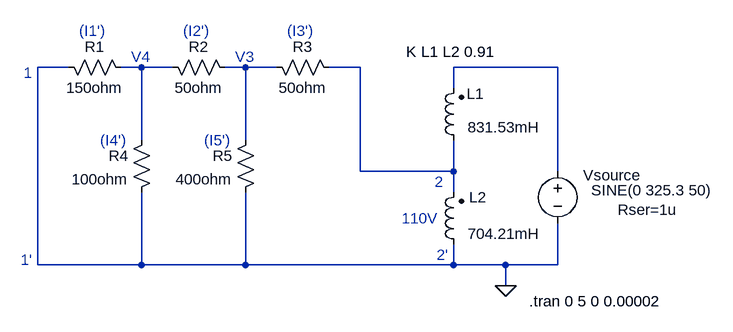
[diagram p0: schematic circuit2.asc]
circuit2.asc, the LTspice schematic file:
Version 4
SHEET 1 1092 680
WIRE 16 -224 -32 -224
WIRE 128 -224 96 -224
WIRE 176 -224 128 -224
WIRE 288 -224 256 -224
WIRE 336 -224 288 -224
WIRE 464 -224 416 -224
WIRE 768 -224 608 -224
WIRE 608 -192 608 -224
WIRE 128 -112 128 -224
WIRE 288 -112 288 -224
WIRE 464 -64 464 -224
WIRE 608 -64 608 -112
WIRE 608 -64 464 -64
WIRE 768 -64 768 -224
WIRE 608 -32 608 -64
WIRE -32 80 -32 -224
WIRE 128 80 128 -32
WIRE 128 80 -32 80
WIRE 288 80 288 -32
WIRE 288 80 128 80
WIRE 608 80 608 48
WIRE 608 80 288 80
WIRE 688 80 608 80
WIRE 768 80 768 16
WIRE 768 80 688 80
WIRE 688 112 688 80
FLAG 688 112 0
SYMBOL voltage 768 -80 M0
WINDOW 0 -128 22 Left 2
WINDOW 3 -238 45 Left 2
WINDOW 123 0 0 Left 0
WINDOW 39 -185 75 Left 2
SYMATTR InstName Vsource
SYMATTR Value SINE(0 325.3 50)
SYMATTR SpiceLine Rser=1u
SYMBOL ind2 624 -96 R180
WINDOW 0 -31 87 Left 2
WINDOW 3 -117 36 Left 2
SYMATTR InstName L1
SYMATTR Value 831.53mH
SYMATTR Type ind
SYMBOL ind2 624 64 R180
WINDOW 0 -35 88 Left 2
WINDOW 3 -117 32 Left 2
SYMATTR InstName L2
SYMATTR Value 704.21mH
SYMATTR Type ind
SYMBOL res 320 -240 M90
WINDOW 0 0 56 VBottom 2
WINDOW 3 32 56 VTop 2
SYMATTR InstName R3
SYMATTR Value 50ohm
SYMBOL res 160 -240 M90
WINDOW 0 0 56 VBottom 2
WINDOW 3 32 56 VTop 2
SYMATTR InstName R2
SYMATTR Value 50ohm
SYMBOL res 0 -240 M90
WINDOW 0 0 56 VBottom 2
WINDOW 3 32 56 VTop 2
SYMATTR InstName R1
SYMATTR Value 150ohm
SYMBOL res 304 -128 M0
SYMATTR InstName R5
SYMATTR Value 400ohm
SYMBOL res 144 -128 M0
SYMATTR InstName R4
SYMATTR Value 100ohm
TEXT 672 -248 Right 2 !K L1 L2 0.91
TEXT 928 136 Right 2 !.tran 0 5 0 0.00002
TEXT 600 64 Right 2 ;2'
TEXT 592 -48 Right 2 ;2
TEXT -40 -216 Right 2 ;1
TEXT -40 72 Right 2 ;1'
TEXT 528 8 Left 2 ;110V
TEXT 272 -240 Left 2 ;V3
TEXT 112 -240 Left 2 ;V4
TEXT 32 -280 Left 2 ;(I1')
TEXT 192 -280 Left 2 ;(I2')
TEXT 352 -280 Left 2 ;(I3')
TEXT 64 -112 Left 2 ;(I4')
TEXT 224 -112 Left 2 ;(I5')

The netlist it stands for:
* circuit2.asc
Vsource N004 0 SINE(0 325.3 50) Rser=1u
L1 N003 N004 831.53mH
L2 0 N003 704.21mH
R3 N002 N003 50ohm
R2 N001 N002 50ohm
R1 0 N001 150ohm
R5 N002 0 400ohm
R4 N001 0 100ohm
K L1 L2 0.91
.tran 0 5 0 0.00002
* 2'
* 2
* 1
* 1'
* 110V
* V3
* V4
* (I1')
* (I2')
* (I3')
* (I4')
* (I5')
.backanno
.end